# EAGLE schematic e-ink-display-v020-teardrop (EAGLE 7.3.0)
CNAME: e-ink-display; CREVISION: 0.0.3; DESIGNER: kennethlimcp

## Sheet 1 of 4: Power supply
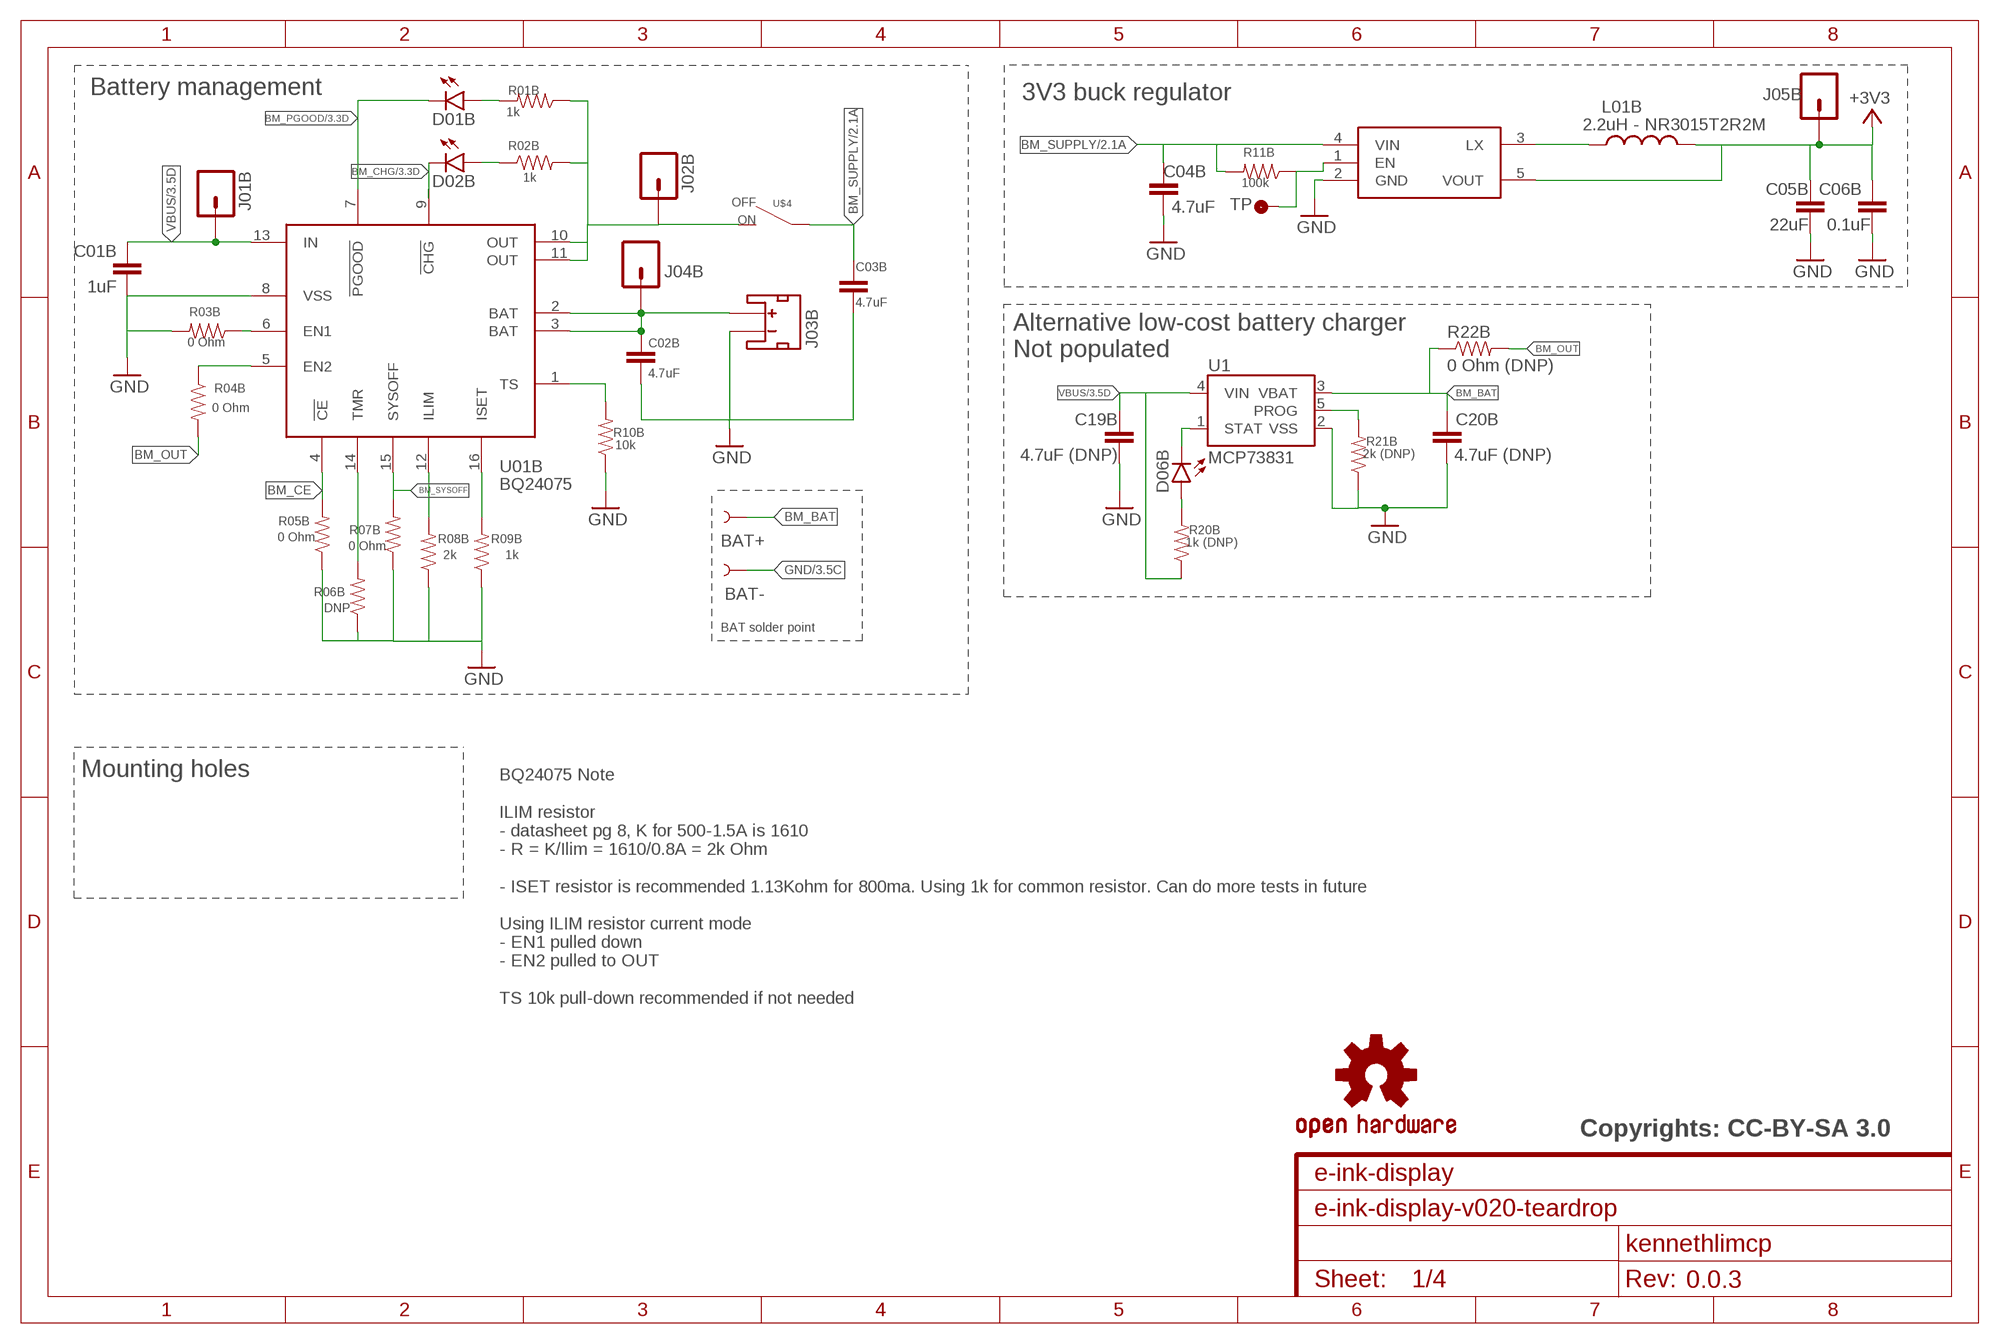
[diagram p0: schematic, sheet 1]

### Parts
BAT+  TEST-POINTBOTH_SQ  [TP_15_BOTH-SQ]
BAT-  TEST-POINTBOTHBOTH  [TP_15_BOTH]
C01B  1uF  CAP0603-CAP  [0603-CAP]
C02B  4.7uF  CAP0603-CAP  [0603-CAP]
C03B  4.7uF  CAP0603-CAP  [0603-CAP]
C04B  4.7uF  CAP0603-CAP  [0603-CAP]
C05B  22uF  CAP0603-CAP  [0603-CAP]
C06B  0.1uF  CAP0603-CAP  [0603-CAP]
C19B  4.7uF (DNP)  CAP0603-CAP  [0603-CAP]
C20B  4.7uF (DNP)  CAP0603-CAP  [0603-CAP]
D01B  LED0603  [LED-0603]
D02B  LED0603  [LED-0603]
D06B  LED0603  [LED-0603]
J01B  M01PTH  [1X01]
J02B  M01PTH  [1X01]
J03B  JST_2MM_MALE  [JST-2-SMD]
J04B  M01PTH  [1X01]
J05B  M01PTH  [1X01]
L01B  2.2uH - NR3015T2R2M  INDUCTOR-SPARKFUNNR3015T4R7M  [INDUCTOR-NR3015]
LOGO1  OSHW-LOGOPAD  [OSHW-LOGO-M-PAD]
R01B  1k  RESISTOR0603-RES  [0603-RES]
R02B  1k  RESISTOR0603-RES  [0603-RES]
R03B  0 Ohm  RESISTOR0603-RES  [0603-RES]
R04B  0 Ohm  RESISTOR0603  [0603-RES]
R05B  0 Ohm  RESISTOR0603  [0603-RES]
R06B  DNP  RESISTOR0603  [0603-RES]
R07B  0 Ohm  RESISTOR0603  [0603-RES]
R08B  2k  RESISTOR0603  [0603-RES]
R09B  1k  RESISTOR0603-RES  [0603-RES]
R10B  10k  RESISTOR0603  [0603-RES]
R11B  100k  RESISTOR0603  [0603-RES]
R20B  1k (DNP)  RESISTOR0603  [0603-RES]
R21B  2k (DNP)  RESISTOR0603  [0603-RES]
R22B  0 Ohm (DNP)  RESISTOR1206  [1206]
TP01B  TP1  [TP35_BOT]
U1  MCP73831  [SOT23-5]
U01B  BQ24075  BQ2407  [PVQFN-16]
U02B  R8008-33  [SOT23-5]
U$4  SWITCHSLIDE  [CHANGE_OVER_SLIDE]

### Nets
+3V3: C05B.2 C06B.2 J05B.1 L01B.2 U02B.5(VOUT) ; also sheet 3,4
BM_BAT: BAT+.P$1 C02B.2 C20B.2 J03B.2(+) J04B.1 R22B.1 U1.3(VBAT) U01B.2(BAT) U01B.3(BAT)
BM_CE: R05B.2 U01B.4(!CE)
BM_CHG: D02B.C U01B.9(!CHG) ; also sheet 3,4
BM_OUT: J02B.1 R01B.1 R02B.2 R04B.2 R22B.2 U01B.10(OUT) U01B.11(OUT) U$4.2
BM_PGOOD: D01B.C U01B.7(!PGOOD) ; also sheet 3,4
BM_SUPPLY: C03B.2 C04B.2 R11B.2 U02B.4(VIN) U$4.1 ; also sheet 2
BM_SYSOFF: R07B.2 U01B.15(SYSOFF)
GND: BAT-.P$1 C01B.1 C02B.1 C03B.1 C04B.1 C05B.1 C06B.1 C19B.1 C20B.1 J03B.1(-) R03B.2 R05B.1 R06B.1 R07B.1 R08B.1 R09B.1 R10B.1 R21B.1 U1.2(VSS) U01B.8(VSS) U02B.2(GND) ; also sheet 2,3,4
N$4: R08B.2 U01B.12(ILIM)
N$9: R09B.2 U01B.16(ISET)
N$11: R04B.1 U01B.5(EN2)
N$12: R03B.1 U01B.6(EN1)
N$13: R06B.2 U01B.14(TMR)
N$15: R10B.2 U01B.1(TS)
N$17: D02B.A R02B.1
N$18: D01B.A R01B.2
N$19: R21B.2 U1.5(PROG)
N$21: R11B.1 TP01B.P$1(TP) U02B.1(EN)
N$23: L01B.1 U02B.3(LX)
N$30: D06B.C U1.1(STAT)
N$37: D06B.A R20B.2
VBUS: C01B.2 C19B.2 J01B.1 R20B.1 U1.4(VIN) U01B.13(IN) ; also sheet 3
Unconnected: J03B.NC1(PAD1) J03B.NC2(PAD2)

### Notes on the sheet
- Battery management | 3V3 buck regulator
- Alternative low-cost battery charger
  Not populated
- BAT solder point
- Mounting holes
- BQ24075 Note
  
  ILIM resistor
  - datasheet pg 8, K for 500-1.5A is 1610
  - R = K/Ilim = 1610/0.8A = 2k Ohm
  
  - ISET resistor is recommended 1.13Kohm for 800ma. Using 1k for common resistor. Can do more tests in future
  
  Using ILIM resistor current mode
  - EN1 pulled down
  - EN2 pulled to OUT
  
  TS 10k pull-down recommended if not needed
- Copyrights: CC-BY-SA 3.0

## Sheet 2 of 4: e-ink power supply
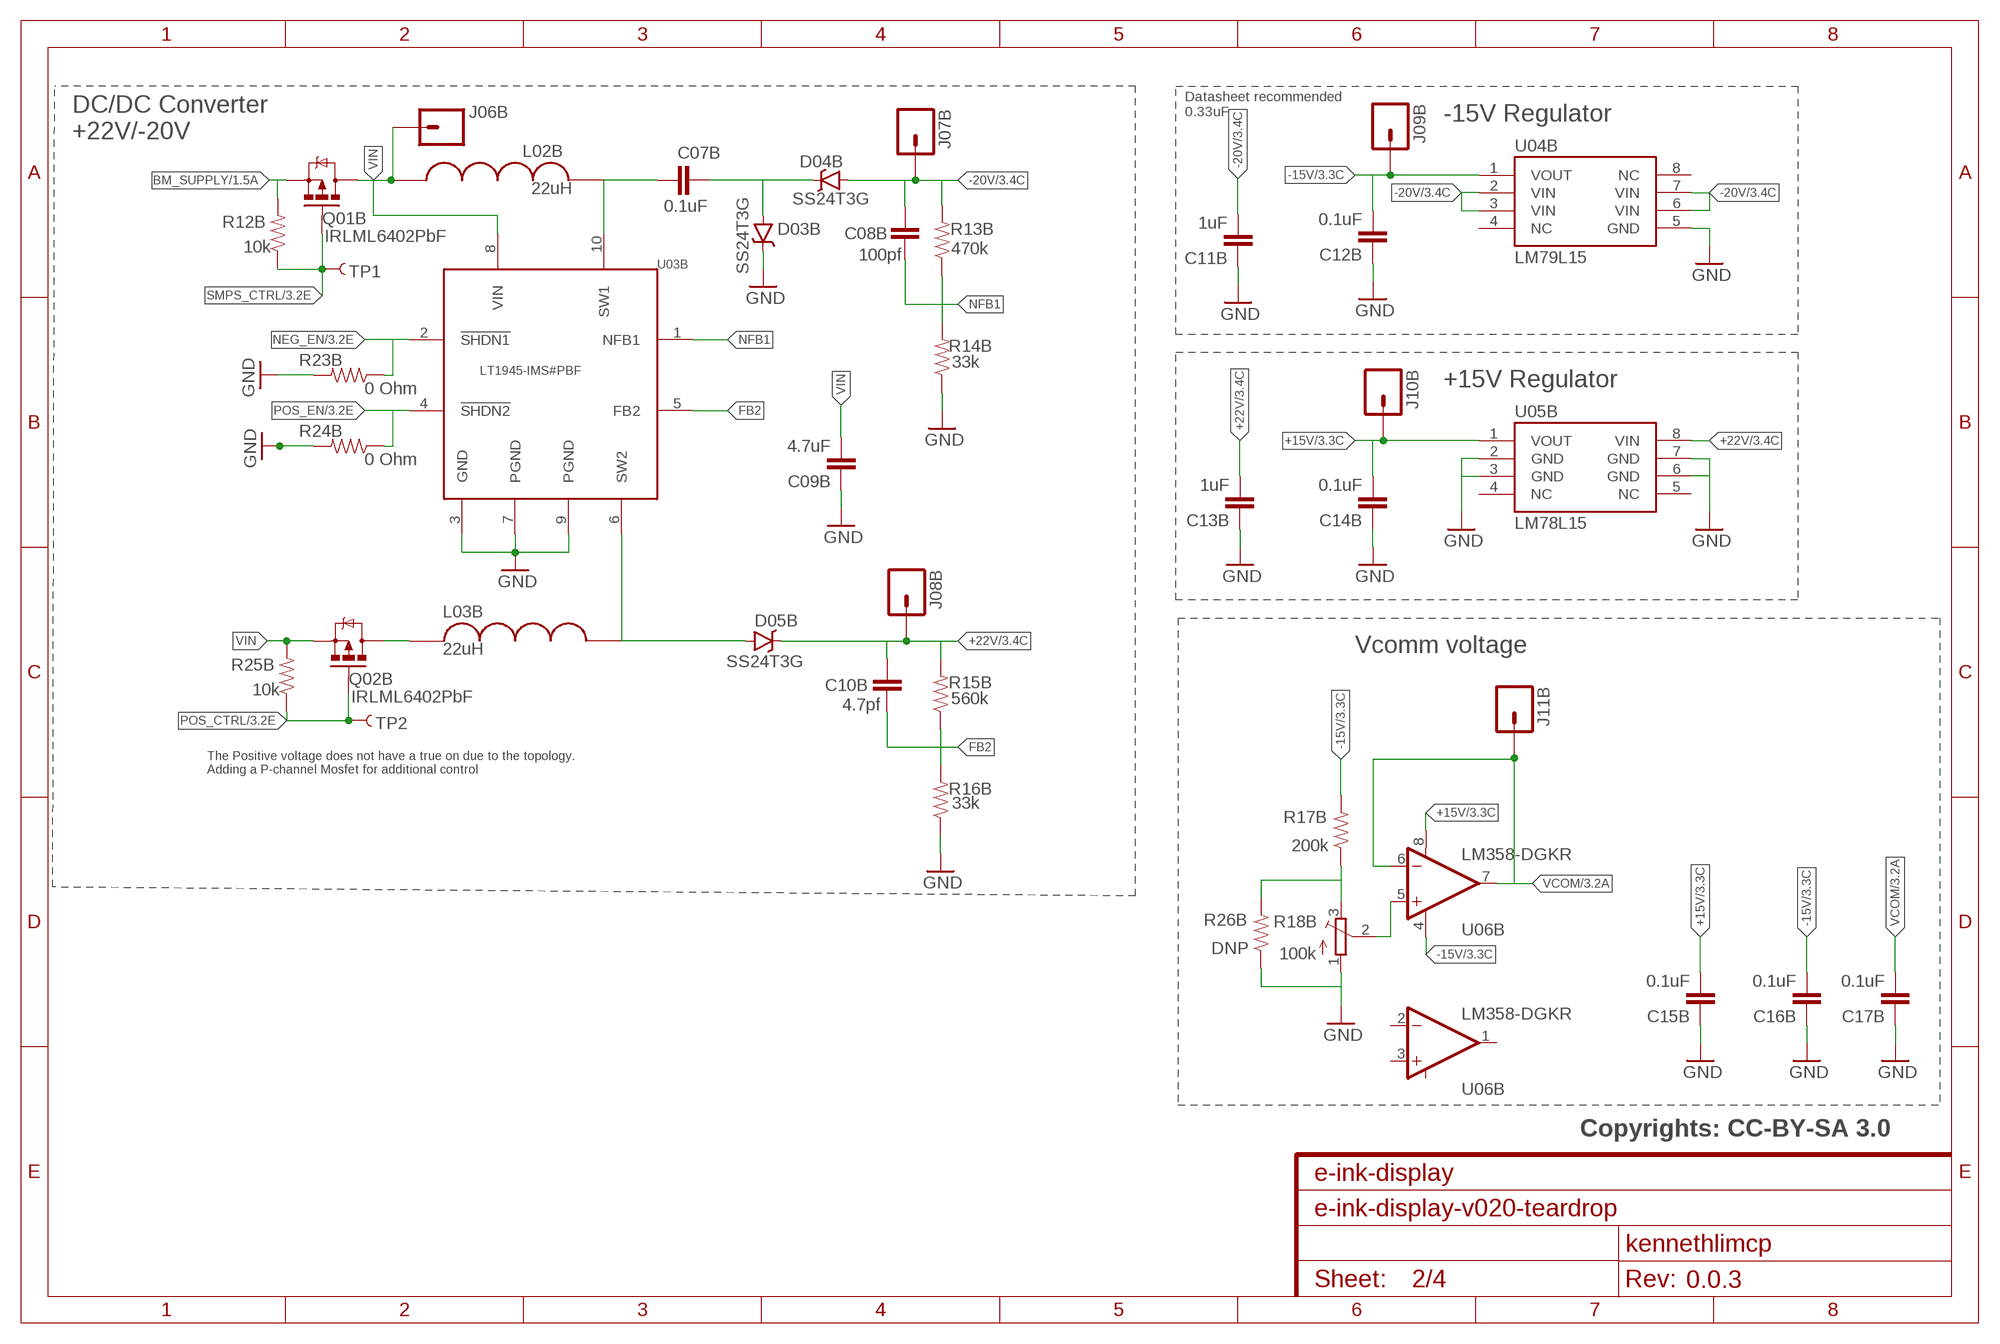
[diagram p1: schematic, sheet 2]

### Parts
C07B  0.1uF  CAP0603-CAP  [0603-CAP]
C08B  100pf  CAP0603-CAP  [0603-CAP]
C09B  4.7uF  CAP0603-CAP  [0603-CAP]
C10B  4.7pf  CAP0603-CAP  [0603-CAP]
C11B  1uF  CAP0603-CAP  [0603-CAP]
C12B  0.1uF  CAP0603-CAP  [0603-CAP]
C13B  1uF  CAP0603-CAP  [0603-CAP]
C14B  0.1uF  CAP0603-CAP  [0603-CAP]
C15B  0.1uF  CAP0603-CAP  [0603-CAP]
C16B  0.1uF  CAP0603-CAP  [0603-CAP]
C17B  0.1uF  CAP0603-CAP  [0603-CAP]
D03B  SS24T3G  [SMA-DIODE]
D04B  SS24T3G  [SMA-DIODE]
D05B  SS24T3G  [SMA-DIODE]
J06B  M01PTH  [1X01]
J07B  M01PTH  [1X01]
J08B  M01PTH  [1X01]
J09B  M01PTH  [1X01]
J10B  M01PTH  [1X01]
J11B  M01PTH  [1X01]
L02B  22uH  INDUCTOR  [4040(1515)]
L03B  22uH  INDUCTOR  [4040(1515)]
Q01B  IRLML6402PbF  MOSFET-PCHANNELSMD  [SOT23-3]
Q02B  IRLML6402PbF  MOSFET-PCHANNELSMD  [SOT23-3]
R12B  10k  RESISTOR0603  [0603-RES]
R13B  470k  RESISTOR0603  [0603-RES]
R14B  33k  RESISTOR0603  [0603-RES]
R15B  560k  RESISTOR0603  [0603-RES]
R16B  33k  RESISTOR0603  [0603-RES]
R17B  200k  RESISTOR0603  [0603-RES]
R18B  100k  TRIMPOTTC33X  [TC33X]
R23B  0 Ohm  RESISTOR0603  [0603-RES]
R24B  0 Ohm  RESISTOR0603  [0603-RES]
R25B  10k  RESISTOR0603  [0603-RES]
R26B  DNP  RESISTOR0603  [0603-RES]
TP1  TEST-POINTBOTHBOTH  [TP_15_BOTH]
TP2  TEST-POINTBOTHBOTH  [TP_15_BOTH]
U03B  LT1945-IMS#PBF  [MSOP-10]
U04B  LM79L15  [SO08]
U05B  LM78L15  [SO08]
U06B  LM358-DGKR  [MSOP-8]

### Nets
+15V: C14B.2 C15B.2 J10B.1 U05B.1(VOUT) U06B.8(V+) ; also sheet 3
+22V: C10B.2 C13B.2 D05B.C J08B.1 R15B.2 U05B.8(VIN) ; also sheet 3
-15V: C12B.2 C16B.2 J09B.1 R17B.2 U04B.1(VOUT) U06B.4(V-) ; also sheet 3
-20V: C08B.2 C11B.2 D04B.A J07B.1 R13B.2 U04B.2(VIN) U04B.3(VIN) U04B.6(VIN) U04B.7(VIN) ; also sheet 3
BM_SUPPLY: Q01B.2(S) R12B.2 ; also sheet 1
FB2: C10B.1 R15B.1 R16B.2 U03B.5(FB2)
GND: C09B.1 C11B.1 C12B.1 C13B.1 C14B.1 C15B.1 C16B.1 C17B.1 D03B.C R14B.1 R16B.1 R18B.1(A) R23B.2 R24B.2 R26B.1 U03B.3(GND) U03B.7(PGND) U03B.9(PGND) U04B.5(GND) U05B.2(GND) U05B.3(GND) U05B.6(GND) U05B.7(GND) ; also sheet 1,3,4
N$2: C07B.1 L02B.P$2 U03B.10(SW1)
N$3: C07B.2 D03B.A D04B.C
N$6: R18B.2(S) U06B.5(+IN2)
N$8: D05B.A L03B.P$2 U03B.6(SW2)
N$25: L03B.P$1 Q02B.3(D)
N$36: R17B.1 R18B.3(E) R26B.2
NEG_EN: R23B.1 U03B.2(!SHDN1) ; also sheet 3
NFB1: C08B.1 R13B.1 R14B.2 U03B.1(NFB1)
POS_CTRL: Q02B.1(G) R25B.1 TP2.P$1 ; also sheet 3
POS_EN: R24B.1 U03B.4(!SHDN2) ; also sheet 3
SMPS_CTRL: Q01B.1(G) R12B.1 TP1.P$1 ; also sheet 3
VCOM: C17B.2 J11B.1 U06B.6(-IN2) U06B.7(OUT2) ; also sheet 3
VIN: C09B.2 J06B.1 L02B.P$1 Q01B.3(D) Q02B.2(S) R25B.2 U03B.8(VIN)
Unconnected: U04B.4(NC) U04B.8(NC) U05B.4(NC) U05B.5(NC) U06B.1(OUT1) U06B.2(-IN1) U06B.3(+IN1)

### Notes on the sheet
- Datasheet recommended
  0.33uF
- -15V Regulator
- DC/DC Converter
  +22V/-20V
- +15V Regulator
- Vcomm voltage
- The Positive voltage does not have a true on due to the topology. 
  Adding a P-channel Mosfet for additional control
- Copyrights: CC-BY-SA 3.0

## Sheet 3 of 4: e-ink display & MCU
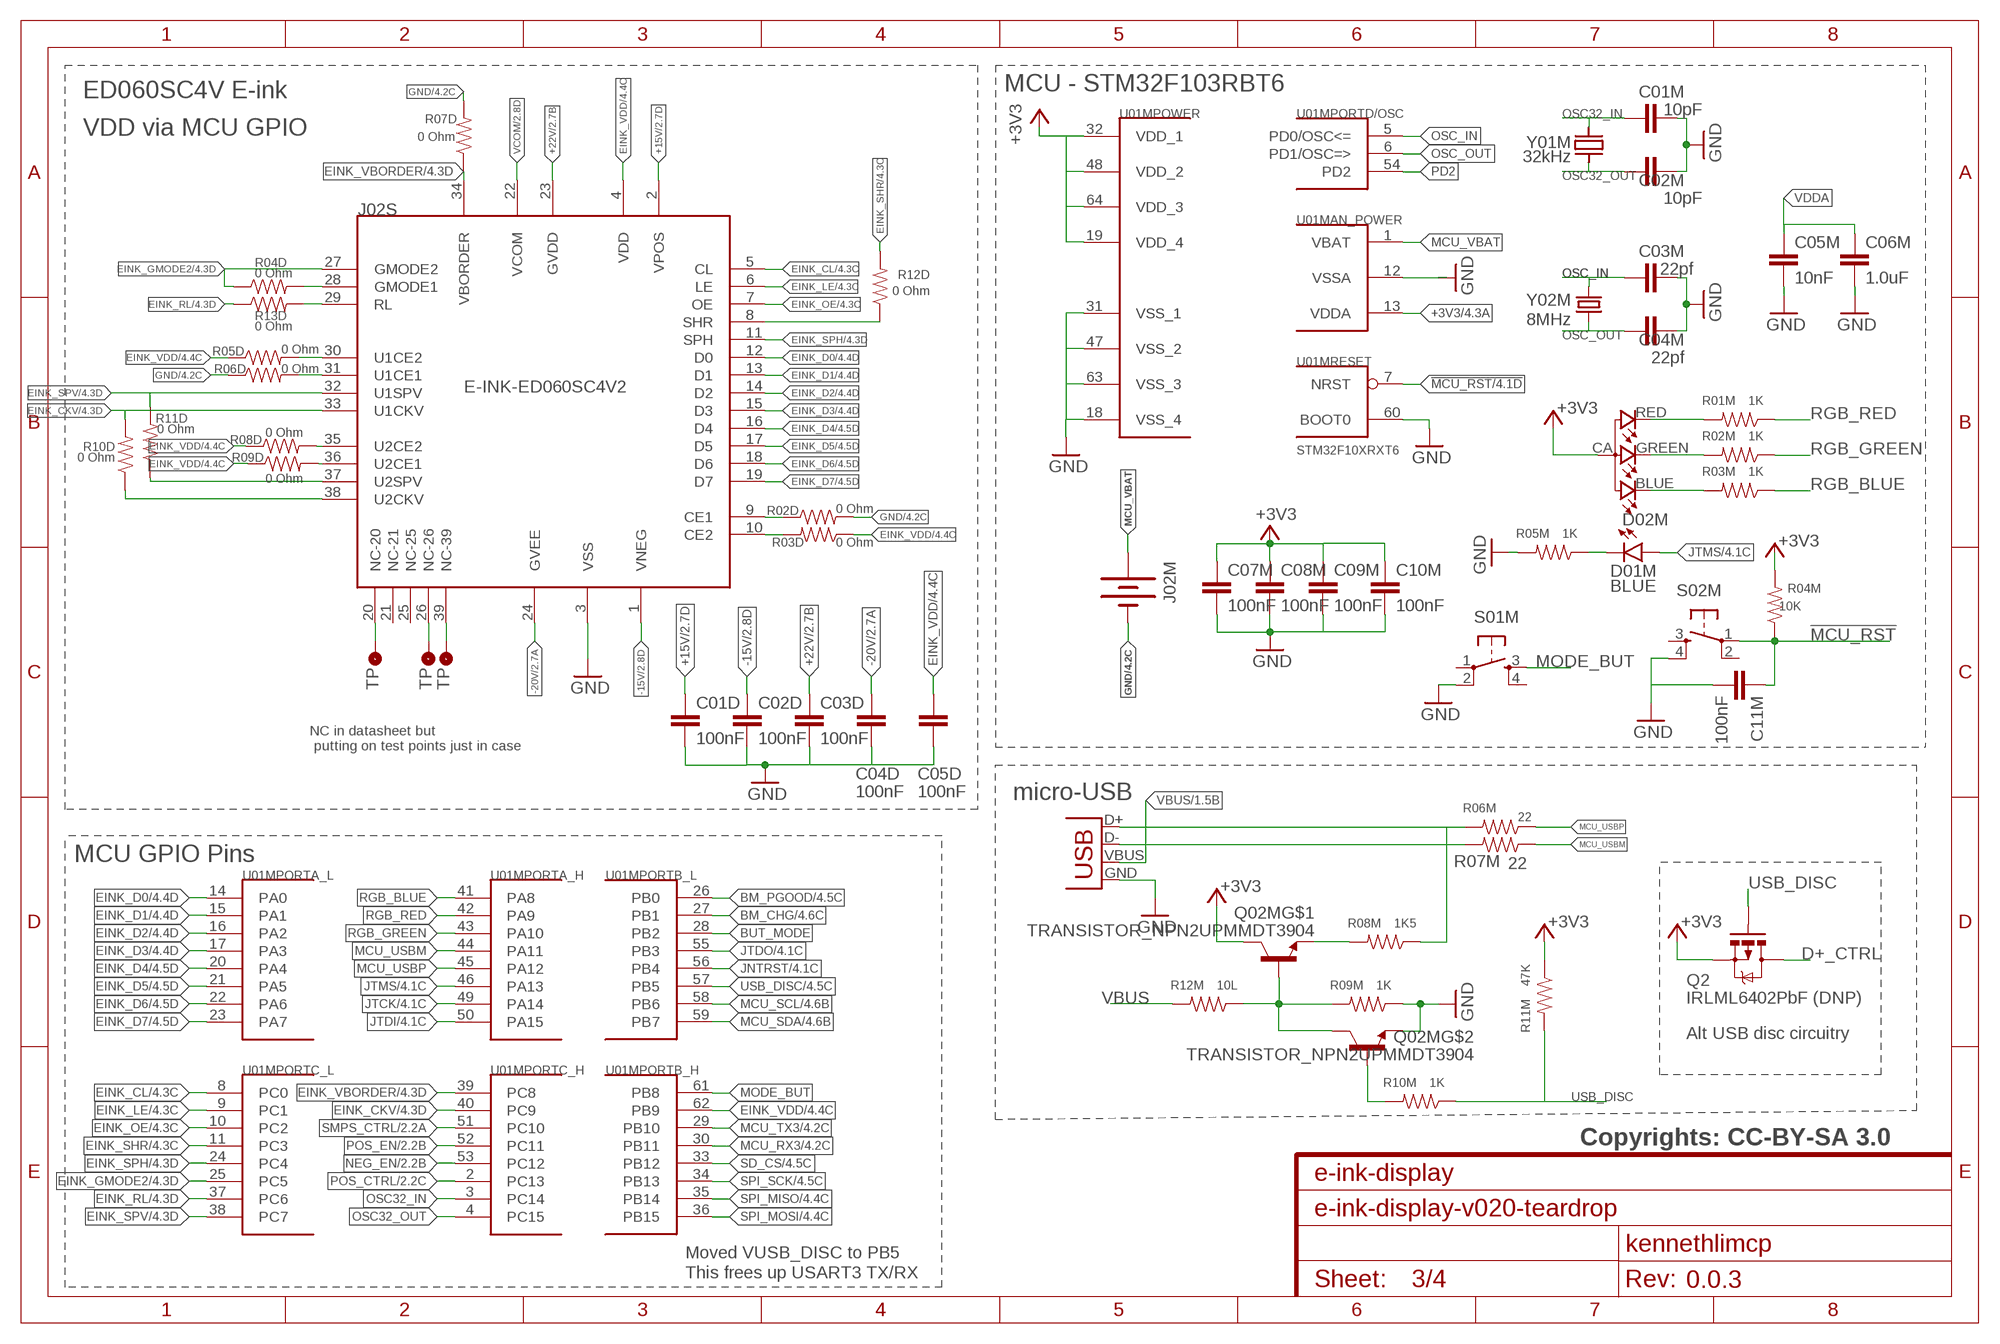
[diagram p2: schematic, sheet 3]

### Parts
C01D  100nF  0.1UF-25V(+80/-20%)(0603)  [0603-CAP]
C01M  10pF  10PF-50V-5%(0603)  [0603-CAP]
C02D  100nF  0.1UF-25V(+80/-20%)(0603)  [0603-CAP]
C02M  10pF  10PF-50V-5%(0603)  [0603-CAP]
C03D  100nF  0.1UF-25V(+80/-20%)(0603)  [0603-CAP]
C03M  22pf  CAP0603-CAP  [0603-CAP]
C04D  100nF  0.1UF-25V(+80/-20%)(0603)  [0603-CAP]
C04M  22pf  CAP0603-CAP  [0603-CAP]
C05D  100nF  0.1UF-25V(+80/-20%)(0603)  [0603-CAP]
C05M  10nF  0.1UF-25V(+80/-20%)(0603)  [0603-CAP]
C06M  1.0uF  1.0UF-16V-10%(0603)  [0603-CAP]
C07M  100nF  0.1UF-25V(+80/-20%)(0603)  [0603-CAP]
C08M  100nF  0.1UF-25V(+80/-20%)(0603)  [0603-CAP]
C09M  100nF  0.1UF-25V(+80/-20%)(0603)  [0603-CAP]
C10M  100nF  0.1UF-25V(+80/-20%)(0603)  [0603-CAP]
C11M  100nF  0.1UF-25V(+80/-20%)(0603)  [0603-CAP]
D01M  BLUE  LED0603  [LED-0603]
D02M  RGB-LED-CLMVB-FKARGB  [PLCC4-2MM-RGB]
J01M  USBUSB-MICROB-PAD-EXTEND  [USB-MICROB-SLOT-HOLE-EXTEND]
J02M  BATTERY20PTH  [BATTCOM_20MM_PTH]
J02S  E-INK-ED060SC4V2  [FPC-0.3-39]
Q2  IRLML6402PbF (DNP)  MOSFET-PCHANNELSMD  [SOT23-3]
Q02M  TRANSISTOR_NPN2UPMMDT3904  [SOT363]
R01M  1K  RESISTOR0603-RES  [0603-RES]
R02D  0 Ohm  RESISTOR0603-RES  [0603-RES]
R02M  1K  RESISTOR0603-RES  [0603-RES]
R03D  0 Ohm  RESISTOR0603-RES  [0603-RES]
R03M  1K  RESISTOR0603-RES  [0603-RES]
R04D  0 Ohm  RESISTOR0603-RES  [0603-RES]
R04M  10K  RESISTOR0603-RES  [0603-RES]
R05D  0 Ohm  RESISTOR0603-RES  [0603-RES]
R05M  1K  RESISTOR0603-RES  [0603-RES]
R06D  0 Ohm  RESISTOR0603-RES  [0603-RES]
R06M  22  RESISTOR0603-RES  [0603-RES]
R07D  0 Ohm  RESISTOR0603-RES  [0603-RES]
R07M  22  RESISTOR0603-RES  [0603-RES]
R08D  0 Ohm  RESISTOR0603-RES  [0603-RES]
R08M  1K5  RESISTOR0603-RES  [0603-RES]
R09D  0 Ohm  RESISTOR0603-RES  [0603-RES]
R09M  1K  RESISTOR0603-RES  [0603-RES]
R10D  0 Ohm  RESISTOR0603-RES  [0603-RES]
R10M  1K  RESISTOR0603-RES  [0603-RES]
R11D  0 Ohm  RESISTOR0603-RES  [0603-RES]
R11M  47K  RESISTOR0603-RES  [0603-RES]
R12D  0 Ohm  RESISTOR0603-RES  [0603-RES]
R12M  10L  RESISTOR0603-RES  [0603-RES]
R13D  0 Ohm  RESISTOR0603-RES  [0603-RES]
S01M  TAC_SWITCHSMD  [TACTILE_SWITCH_SMD]
S02M  TAC_SWITCHSMD  [TACTILE_SWITCH_SMD]
U01M  STM32F10XRXT6  [TQFP64]
U$1  TP1  [TP35_BOT]
U$8  TP1  [TP35_BOT]
U$9  TP1  [TP35_BOT]
Y01M  32kHz  Q_FC135  [FC135]
Y02M  8MHz  CRYSTAL5X3  [CRYSTAL-SMD-5X3]

### Nets
!MCU_RST: C11M.1 R04M.1 S02M.1 U01M.7(RESET:NRST) ; also sheet 4
+3V3: C07M.1 C08M.1 C09M.1 C10M.1 D02M.CA Q2.2(S) Q02M.6(C) R04M.2 R11M.1 U01M.13(AN_POWER:VDDA) U01M.19(POWER:VDD_4) U01M.32(POWER:VDD_1) U01M.48(POWER:VDD_2) U01M.64(POWER:VDD_3) ; also sheet 1,4
+15V: C01D.1 J02S.2(VPOS) ; also sheet 2
+22V: C03D.1 J02S.23(GVDD) ; also sheet 2
-15V: C02D.1 J02S.1(VNEG) ; also sheet 2
-20V: C04D.1 J02S.24(GVEE) ; also sheet 2
BM_CHG: U01M.27(PORTB_L:PB1) ; also sheet 1,4
BM_PGOOD: U01M.26(PORTB_L:PB0) ; also sheet 1,4
BUT_MODE: U01M.28(PORTB_L:PB2)
CE2: J02S.10(CE2) R03D.2
D+_CTRL: Q2.3(D) Q02M.1(E) R08M.2
EINK_CKV: J02S.33(U1CKV) R10D.2 U01M.40(PORTC_H:PC9) ; also sheet 4
EINK_CL: J02S.5(CL) U01M.8(PORTC_L:PC0) ; also sheet 4
EINK_D0: J02S.12(D0) U01M.14(PORTA_L:PA0) ; also sheet 4
EINK_D1: J02S.13(D1) U01M.15(PORTA_L:PA1) ; also sheet 4
EINK_D2: J02S.14(D2) U01M.16(PORTA_L:PA2) ; also sheet 4
EINK_D3: J02S.15(D3) U01M.17(PORTA_L:PA3) ; also sheet 4
EINK_D4: J02S.16(D4) U01M.20(PORTA_L:PA4) ; also sheet 4
EINK_D5: J02S.17(D5) U01M.21(PORTA_L:PA5) ; also sheet 4
EINK_D6: J02S.18(D6) U01M.22(PORTA_L:PA6) ; also sheet 4
EINK_D7: J02S.19(D7) U01M.23(PORTA_L:PA7) ; also sheet 4
EINK_GMODE2: J02S.27(GMODE2) R04D.1 U01M.25(PORTC_L:PC5) ; also sheet 4
EINK_LE: J02S.6(LE) U01M.9(PORTC_L:PC1) ; also sheet 4
EINK_OE: J02S.7(OE) U01M.10(PORTC_L:PC2) ; also sheet 4
EINK_RL: R13D.1 U01M.37(PORTC_L:PC6) ; also sheet 4
EINK_SHR: R12D.2 U01M.11(PORTC_L:PC3) ; also sheet 4
EINK_SPH: J02S.11(SPH) U01M.24(PORTC_L:PC4) ; also sheet 4
EINK_SPV: J02S.32(U1SPV) R11D.2 U01M.38(PORTC_L:PC7) ; also sheet 4
EINK_VBORDER: J02S.34(VBORDER) R07D.1 U01M.39(PORTC_H:PC8) ; also sheet 4
EINK_VDD: C05D.1 J02S.4(VDD) R03D.1 R05D.1 R08D.1 R09D.1 U01M.62(PORTB_H:PB9) ; also sheet 4
GND: C01D.2 C01M.2 C02D.2 C02M.2 C03D.2 C03M.2 C04D.2 C04M.2 C05D.2 C05M.2 C06M.2 C07M.2 C08M.2 C09M.2 C10M.2 C11M.2 J01M.GND J02M.2(-) J02S.3(VSS) Q02M.4(E) R02D.2 R05M.2 R06D.1 R07D.2 R09M.1 S01M.2 S02M.4 U01M.12(AN_POWER:VSSA) U01M.18(POWER:VSS_4) U01M.31(POWER:VSS_1) U01M.47(POWER:VSS_2) U01M.60(RESET:BOOT0) U01M.63(POWER:VSS_3) ; also sheet 1,2,4
JNTRST: U01M.56(PORTB_L:PB4) ; also sheet 4
JTCK: U01M.49(PORTA_H:PA14) ; also sheet 4
JTDI: U01M.50(PORTA_H:PA15) ; also sheet 4
JTDO: U01M.55(PORTB_L:PB3) ; also sheet 4
JTMS: D01M.A U01M.46(PORTA_H:PA13) ; also sheet 4
MCU_RX3: U01M.30(PORTB_H:PB11) ; also sheet 4
MCU_SCL: U01M.58(PORTB_L:PB6) ; also sheet 4
MCU_SDA: U01M.59(PORTB_L:PB7) ; also sheet 4
MCU_TX3: U01M.29(PORTB_H:PB10) ; also sheet 4
MCU_USBM: R07M.1 U01M.44(PORTA_H:PA11)
MCU_USBP: R06M.1 U01M.45(PORTA_H:PA12)
MCU_VBAT: J02M.1(+) U01M.1(AN_POWER:VBAT)
MODE_BUT: S01M.3 U01M.61(PORTB_H:PB8)
N$: J01M.D+ R06M.2 R08M.1
N$1: J02S.28(GMODE1) R04D.2
N$5: J02S.31(U1CE1) R06D.2
N$14: D02M.RED R01M.2
N$22: Q02M.2(B) Q02M.3(C) R09M.2 R12M.1
N$24: J02S.29(RL) R13D.2
N$26: J02S.35(U2CE2) R08D.2
N$27: J02S.36(U2CE1) R09D.2
N$28: J02S.9(CE1) R02D.1
N$29: J02S.20(NC-20) U$1.P$1(TP)
N$31: J02S.26(NC-26) U$8.P$1(TP)
N$32: J02S.8(SHR) R12D.1
N$33: J02S.39(NC-39) U$9.P$1(TP)
N$35: Q02M.5(B) R10M.2
N$38: D01M.C R05M.1
N$100: J01M.D- R07M.2
NEG_EN: U01M.53(PORTC_H:PC12) ; also sheet 2
OSC32_IN: C01M.1 U01M.3(PORTC_H:PC14) Y01M.X2
OSC32_OUT: C02M.1 U01M.4(PORTC_H:PC15) Y01M.X1
OSC_IN: C03M.1 U01M.5(PORTD/OSC:PD0/OSC<=) Y02M.3
OSC_OUT: C04M.1 U01M.6(PORTD/OSC:PD1/OSC=>) Y02M.1
PD2: U01M.54(PORTD/OSC:PD2)
POS_CTRL: U01M.2(PORTC_H:PC13) ; also sheet 2
POS_EN: U01M.52(PORTC_H:PC11) ; also sheet 2
R02M: D02M.GREEN R02M.2
R03M: D02M.BLUE R03M.2
RGB_BLUE: R03M.1 U01M.41(PORTA_H:PA8)
RGB_GREEN: R02M.1 U01M.43(PORTA_H:PA10)
RGB_RED: R01M.1 U01M.42(PORTA_H:PA9)
SD_CS: U01M.33(PORTB_H:PB12) ; also sheet 4
SMPS_CTRL: U01M.51(PORTC_H:PC10) ; also sheet 2
SPI_MISO: U01M.35(PORTB_H:PB14) ; also sheet 4
SPI_MOSI: U01M.36(PORTB_H:PB15) ; also sheet 4
SPI_SCK: U01M.34(PORTB_H:PB13) ; also sheet 4
U1CE2: J02S.30(U1CE2) R05D.2
U2CKV: J02S.38(U2CKV) R10D.1
U2SPV: J02S.37(U2SPV) R11D.1
USB_DISC: Q2.1(G) R10M.1 R11M.2 U01M.57(PORTB_L:PB5) ; also sheet 4
VBUS: J01M.VBUS R12M.2 ; also sheet 1
VCOM: J02S.22(VCOM) ; also sheet 2
VDDA: C05M.1 C06M.1
Unconnected: J02S.21(NC-21) J02S.25(NC-25) S01M.1 S01M.4 S02M.2 S02M.3

### Notes on the sheet
- MCU - STM32F103RBT6
- ED060SC4V E-ink
  
  VDD via MCU GPIO
- NC in datasheet but
   putting on test points just in case
- micro-USB
- MCU GPIO Pins
- Alt USB disc circuitry
- Copyrights: CC-BY-SA 3.0
- Moved VUSB_DISC to PB5 
  This frees up USART3 TX/RX

## Sheet 4 of 4: Peripherals
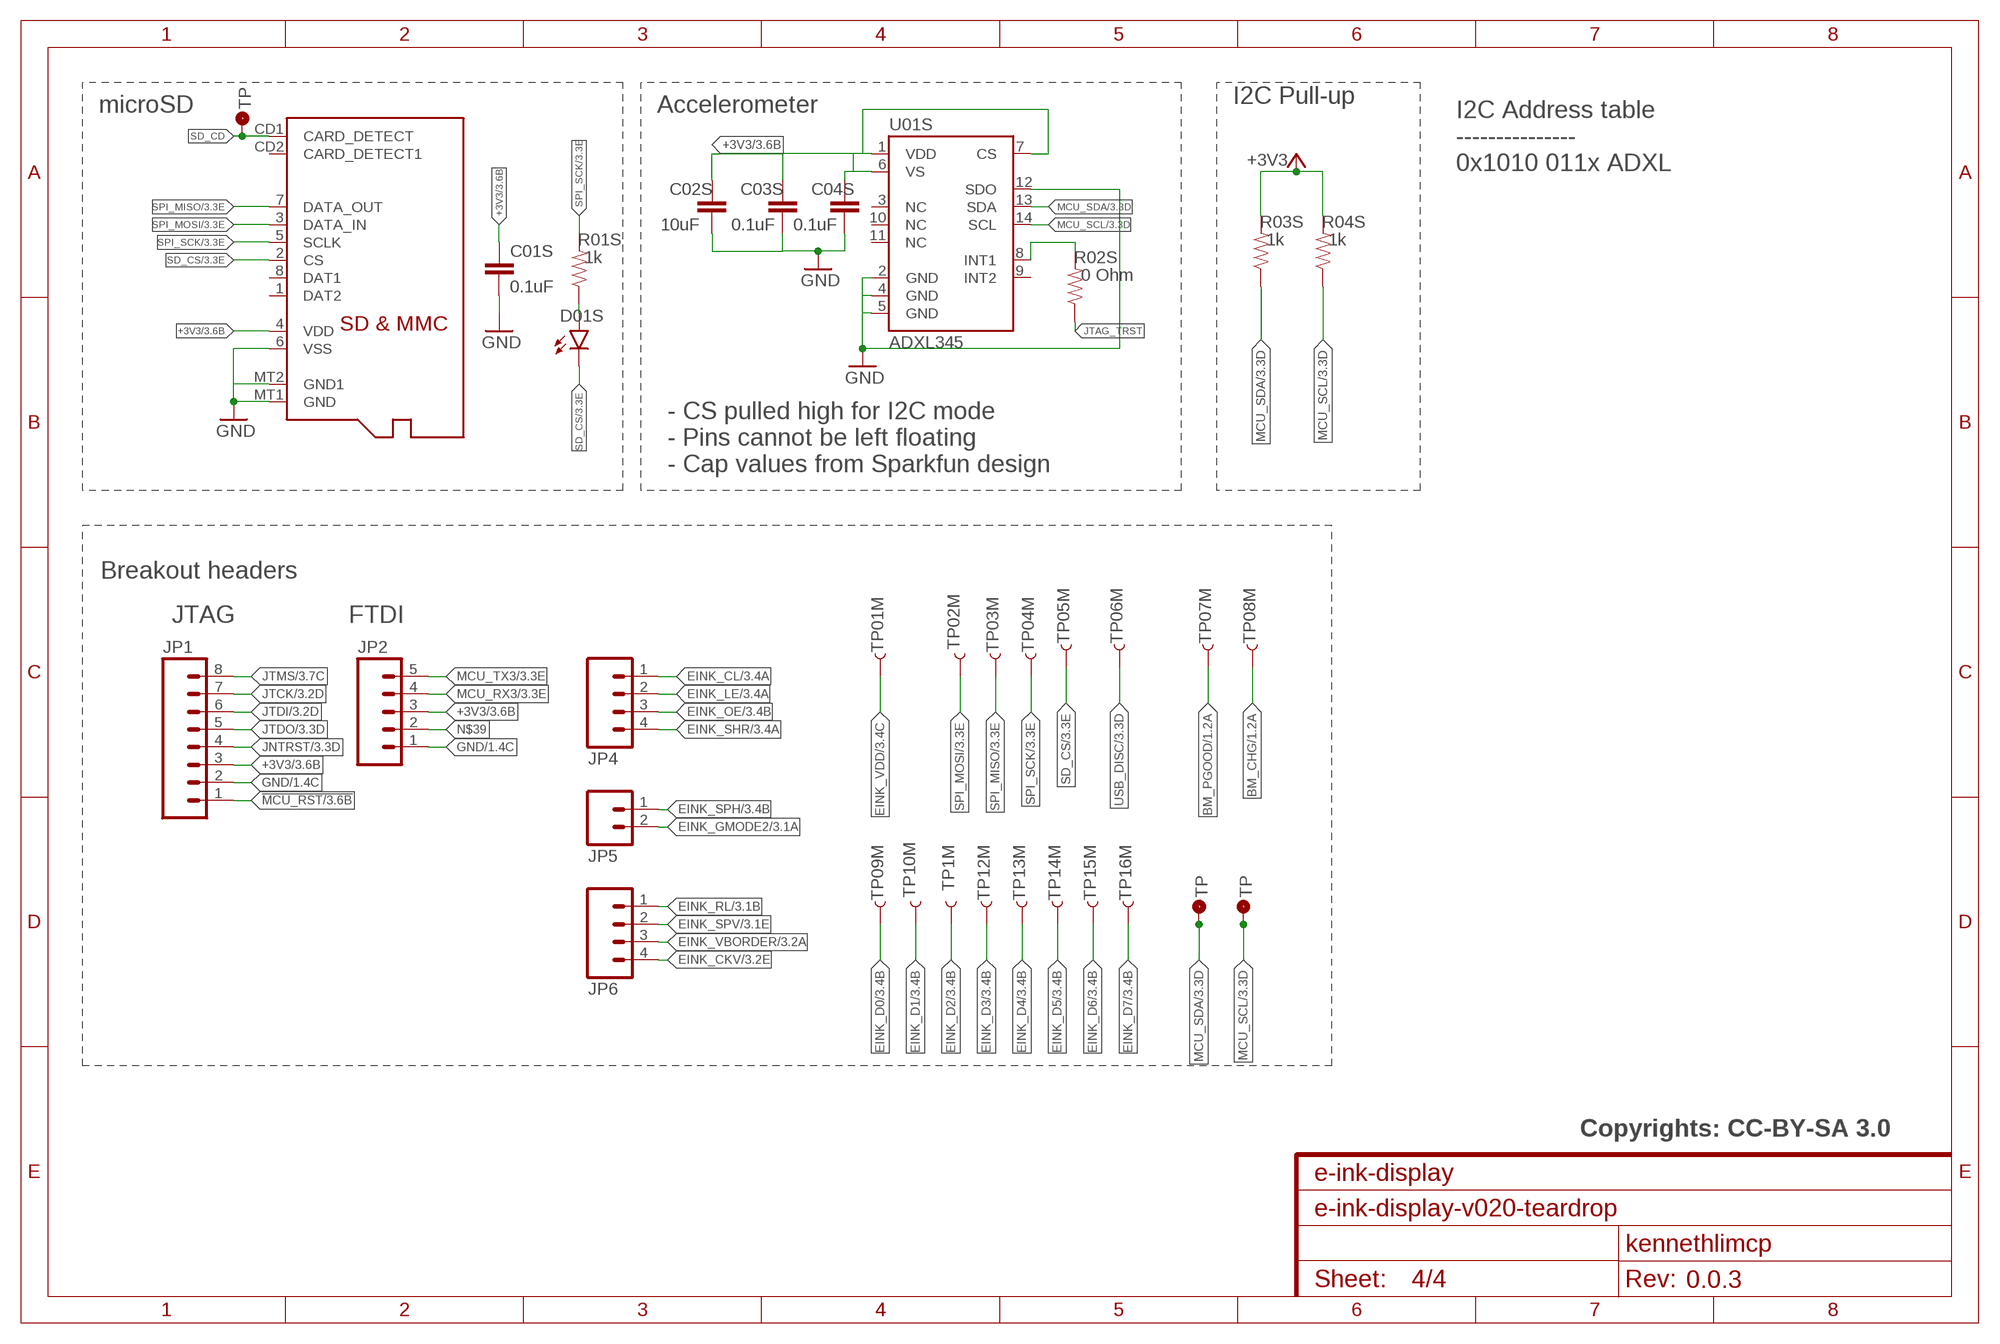
[diagram p3: schematic, sheet 4]

### Parts
C01S  0.1uF  CAP0603-CAP  [0603-CAP]
C02S  10uF  CAP0603-CAP  [0603-CAP]
C03S  0.1uF  CAP0603-CAP  [0603-CAP]
C04S  0.1uF  CAP0603-CAP  [0603-CAP]
D01S  LED0603  [LED-0603]
J01S  MICROSD  [MICROSD]
JP1  M08  [1X08_ROUND]
JP2  M05PTH  [1X05]
JP4  M04PTH  [1X04]
JP5  M02PTH  [1X02]
JP6  M04PTH  [1X04]
R01S  1k  RESISTOR0603-RES  [0603-RES]
R02S  0 Ohm  RESISTOR0603  [0603-RES]
R03S  1k  RESISTOR0603-RES  [0603-RES]
R04S  1k  RESISTOR0603-RES  [0603-RES]
TP01M  TEST-POINTBOTHBOTH  [TP_15_BOTH]
TP1M  TEST-POINTBOTHBOTH  [TP_15_BOTH]
TP02M  TEST-POINTBOTHBOTH  [TP_15_BOTH]
TP03M  TEST-POINTTP_15TH_THRU  [TP_15TH]
TP04M  TEST-POINTBOTHBOTH  [TP_15_BOTH]
TP05M  TEST-POINTBOTHBOTH  [TP_15_BOTH]
TP06M  TEST-POINTBOTHBOTH  [TP_15_BOTH]
TP07M  TEST-POINTBOTHBOTH  [TP_15_BOTH]
TP08M  TEST-POINTBOTHBOTH  [TP_15_BOTH]
TP09M  TEST-POINTBOTHBOTH  [TP_15_BOTH]
TP10M  TEST-POINTBOTHBOTH  [TP_15_BOTH]
TP12M  TEST-POINTBOTHBOTH  [TP_15_BOTH]
TP13M  TEST-POINTBOTHBOTH  [TP_15_BOTH]
TP14M  TEST-POINTBOTHBOTH  [TP_15_BOTH]
TP15M  TEST-POINTBOTHBOTH  [TP_15_BOTH]
TP16M  TEST-POINTBOTHBOTH  [TP_15_BOTH]
TP17M  TP1  [TP35_BOT]
TP18M  TP1  [TP35_BOT]
U01S  ADXL345  [LGA14]
U$5  TP3  [TP60_BOT]

### Nets
!MCU_RST: JP1.1 ; also sheet 3
+3V3: C01S.1 C02S.1 C03S.1 C04S.1 J01S.4(VDD) JP1.3 JP2.3 R03S.2 R04S.2 U01S.1(VDD) U01S.6(VS) U01S.7(CS) ; also sheet 1,3
BM_CHG: TP08M.P$1 ; also sheet 1,3
BM_PGOOD: TP07M.P$1 ; also sheet 1,3
EINK_CKV: JP6.4 ; also sheet 3
EINK_CL: JP4.1 ; also sheet 3
EINK_D0: TP09M.P$1 ; also sheet 3
EINK_D1: TP10M.P$1 ; also sheet 3
EINK_D2: TP1M.P$1 ; also sheet 3
EINK_D3: TP12M.P$1 ; also sheet 3
EINK_D4: TP13M.P$1 ; also sheet 3
EINK_D5: TP14M.P$1 ; also sheet 3
EINK_D6: TP15M.P$1 ; also sheet 3
EINK_D7: TP16M.P$1 ; also sheet 3
EINK_GMODE2: JP5.2 ; also sheet 3
EINK_LE: JP4.2 ; also sheet 3
EINK_OE: JP4.3 ; also sheet 3
EINK_RL: JP6.1 ; also sheet 3
EINK_SHR: JP4.4 ; also sheet 3
EINK_SPH: JP5.1 ; also sheet 3
EINK_SPV: JP6.2 ; also sheet 3
EINK_VBORDER: JP6.3 ; also sheet 3
EINK_VDD: TP01M.P$1 ; also sheet 3
GND: C01S.2 C02S.2 C03S.2 C04S.2 J01S.6(VSS) J01S.MT1(GND) J01S.MT2(GND1) JP1.2 JP2.1 U01S.2(GND) U01S.4(GND) U01S.5(GND) U01S.12(SDO) ; also sheet 1,2,3
JNTRST: JP1.4 ; also sheet 3
JTAG_TRST: R02S.1
JTCK: JP1.7 ; also sheet 3
JTDI: JP1.6 ; also sheet 3
JTDO: JP1.5 ; also sheet 3
JTMS: JP1.8 ; also sheet 3
MCU_RX3: JP2.4 ; also sheet 3
MCU_SCL: R04S.1 TP18M.P$1(TP) U01S.14(SCL) ; also sheet 3
MCU_SDA: R03S.1 TP17M.P$1(TP) U01S.13(SDA) ; also sheet 3
MCU_TX3: JP2.5 ; also sheet 3
N$10: R02S.2 U01S.8(INT1)
N$39: JP2.2
R01S: D01S.A R01S.1
SD_CD: J01S.CD1(CARD_DETECT) U$5.P$1(TP)
SD_CS: D01S.C J01S.2(CS) TP05M.P$1 ; also sheet 3
SPI_MISO: J01S.7(DATA_OUT) TP03M.P$1 ; also sheet 3
SPI_MOSI: J01S.3(DATA_IN) TP02M.P$1 ; also sheet 3
SPI_SCK: J01S.5(SCLK) R01S.2 TP04M.P$1 ; also sheet 3
USB_DISC: TP06M.P$1 ; also sheet 3
Unconnected: J01S.1(DAT2) J01S.8(DAT1) J01S.CD2(CARD_DETECT1) U01S.3(NC) U01S.9(INT2) U01S.10(NC) U01S.11(NC)

### Notes on the sheet
- I2C Pull-up
- microSD | Accelerometer
- I2C Address table
  ---------------
  0x1010 011x ADXL
- - CS pulled high for I2C mode
  - Pins cannot be left floating
  - Cap values from Sparkfun design
- Breakout headers
- JTAG | FTDI
- Copyrights: CC-BY-SA 3.0

## Library data of the parts
BAT+ BAT- TP1 TP01M TP1M TP2 TP02M TP04M TP05M TP06M TP07M TP08M TP09M TP10M TP12M TP13M TP14M TP15M TP16M = kennethlimcp:TEST-POINT: Bare copper test points for troubleshooting or ICT
C01B C01S C02B C02S C03B C03M C03S C04B C04M C04S C05B C06B C07B C08B C09B C10B C11B C12B C13B C14B C15B C16B C17B C19B C20B = SparkFun-Capacitors:CAP: Capacitor Standard 0603 ceramic capacitor, and 0.1" leaded capacitor.
C01D C02D C03D C04D C05D C05M C07M C08M C09M C10M C11M = SparkFun-Capacitors:0.1UF-25V(+80/-20%)(0603): CAP-00810 Ceramic Standard decoupling cap; PROD_ID: CAP-00810; VALUE: 0.1uF
C01M C02M = SparkFun-Capacitors:10PF-50V-5%(0603): CAP-11812; PROD_ID: CAP-11812
C06M = SparkFun-Capacitors:1.0UF-16V-10%(0603): CAP-00868; PROD_ID: CAP-00868
D01B D01M D01S D02B D06B = SparkFun-LED:LED: LEDs Standard schematic elements and footprints for 5mm, 3mm, 1206, and 0603 sized LEDs. 5mm - Spark Fun Electronics SKU : COM-00529 (and others)
D02M = Spark:RGB-LED-CLMVB-FKA: CREE CLMVB-FKA RGB LED 2mm x 2mm
D03B D04B D05B = kennethlimcp:SS24T3G: SS24T3G, Schottky diode 40V, 1A, Vf 500mV Package: DO-214AA
J01B J02B J04B J05B J06B J07B J08B J09B J10B J11B = SparkFun-Connectors:M01: Header 1 Standard 1-pin 0.1" header. Use with straight break away headers (SKU : PRT-00116), right angle break away headers (PRT-00553), swiss pins (PRT-00743), machine pins (PRT-00117), and female headers (PRT-00115).
J01M = Spark:USB
J01S = adafruit:MICROSD: Micro-SD / Transflash card holder with SPI pinout For the 3M # 2908-05WB-MG and/or 4UCON #19656 push-push type
J02M = SparkFun-Electromechanical:BATTERY: Battery Holders Various common sizes : AA, AAA, 18650 (PRT-12895), 20mm coin cell and 12mm coin cell. 20MM_4LEGS, BATT-10373
J02S = kennethlimcp:E-INK-ED060SC4V2
J03B = SparkFun-Connectors:JST_2MM_MALE: Mates to single-cell LiPo batteries. CONN-11443 Now with smashable polarity marks!; BTM_NEG: -; BTM_POS: +; PROD_ID: CONN-11443; TOP_NEG: -; TOP_POS: +
JP1 = SparkFun-Connectors:M08: Header 8 Standard 8-pin 0.1" header. Use with straight break away headers (SKU : PRT-00116), right angle break away headers (PRT-00553), swiss pins (PRT-00743), machine pins (PRT-00117), and female headers (PRT-00115).
JP2 = SparkFun-Connectors:M05: Header 5 Standard 5-pin 0.1" header. Use with straight break away headers (SKU : PRT-00116), right angle break away headers (PRT-00553), swiss pins (PRT-00743), machine pins (PRT-00117), and female headers (PRT-00115). Molex polarized connector foot print use with SKU : PRT-08230 with associated crimp pins and housings.
JP4 JP6 = SparkFun-Connectors:M04: Header 4 Standard 4-pin 0.1" header. Use with straight break away headers (SKU : PRT-00116), right angle break away headers (PRT-00553), swiss pins (PRT-00743), machine pins (PRT-00117), and female headers (PRT-00115). Molex polarized connector foot print use with SKU : PRT-08231 with associated crimp pins and housings. 1MM SMD Version SKU: PRT-10208
JP5 = SparkFun-Connectors:M02: Standard 2-pin 0.1" header. Use with - straight break away headers ( PRT-00116) - right angle break away headers (PRT-00553) - swiss pins (PRT-00743) - machine pins (PRT-00117) - female headers (PRT-00115) Molex polarized connector foot print use with: PRT-08233 with associated crimp pins and housings. 2.54_SCREWTERM for use with PRT-10571. 3.5mm Screw Terminal footprints for PRT-08084 5mm Screw Terminal footprints for use with PRT-08432
L01B = Spark:INDUCTOR-SPARKFUN: Inductors Basic Inductor/Choke - 0603 and 1206. Footprints are not proven and vary greatly between part numbers. SRN6045- 33uH, 20% 1.4A; NR3015T4R7M: 4.7uH
L02B L03B = kennethlimcp:INDUCTOR
LOGO1 = kennethlimcp:OSHW-LOGO: Open Source Hardware Logo This logo indicates the piece of hardware it is found on incorporates a OSHW license and/or adheres to the definition of open source hardware found here: http://freedomdefined.org/OSHW
Q01B Q2 Q02B = SparkFun-DiscreteSemi:MOSFET-PCHANNEL: Generic PMOSFET IRLML2244 - TRANS-11153 (SOT-23 -20V -4.3A) (1.Gate 2.Source 3.Drain) FQP27P06 - COM-10349 <http://www.sparkfun.com/products/10349> (TO-220 -60V -27A) (1.Gate 2.Source 3.Drain)
Q02M = SparkFun-DiscreteSemi:TRANSISTOR_NPN2UP: 2-up package of NPN transistors MMDT3904- TRANS-09373 (SOT-363, 200mA 40V); PROD_ID: TRANS-09373; VALUE: MMDT3904
R01B R01S R02B R02S R03B R03S R04B R04S R05B R06B R07B R08B R09B R10B R11B R12B R13B R14B R15B R16B R17B R20B R21B R22B R23B R24B R25B R26B = SparkFun-Resistors:RESISTOR: Resistor Basic schematic elements and footprints for 0603, 1206, and PTH resistors.
R01M R02D R02M R03D R03M R04D R04M R05D R05M R06D R06M R07D R07M R08D R08M R09D R09M R10D R10M R11D R11M R12D R12M R13D = SparkFun-Passives:RESISTOR: Resistor Basic schematic elements and footprints for 0603, 1206, and PTH resistors.
R18B = adafruit:TRIMPOT: SMT trimmer potentiometer part number TC33X http://www.ladyada.net/library/eagle
S01M S02M = Spark:TAC_SWITCH: SMD Tactiile Switch
TP01B TP17M TP18M U$1 U$5 U$8 U$9 = Spark:TP: Test Points of all sizes and shapes
TP03M = SparkFun-Passives:TEST-POINT: Bare copper test points for troubleshooting or ICT
U1 = SparkFun-PowerIC:MCP73831: Miniature single cell, fully integrated Li-Ion, Li-polymer charge management controller http://ww1.microchip.com/downloads/en/DeviceDoc/20001984g.pdf IC-09995; PROD_ID: IC-09995
U01B = kennethlimcp:BQ2407: 1.5-A USB-Friendly Li-Ion Battery Charger and Power-Path Management IC Series: bq24072, bq24073, bq24074, bq24075, bq24079
U01M = stm32:STM32F10XRXT6: STM32F101/103 64pin LQFP
U01S = SparkFun-Sensors:ADXL345: 3-axis SPI/I2C 2/4/8/16g accelerometer
U02B = Spark:R8008-33
U03B = kennethlimcp:LT1945: LT1945 36V switch, 350mA, Dual micropower DC/DC converter
U04B = kennethlimcp:LM79L15: LM79L15, SOIC-8
U05B = kennethlimcp:LM78L15: LM78L15, SOIC-8
U06B = kennethlimcp:LM358: LM358, two independent, high-gain, Wide Supply Ranges frequency-compensated operational amplifiers MSOP-8
U$4 = kennethlimcp:SWITCH
Y01M = Spark:Q
Y02M = SparkFun-FreqCtrl:CRYSTAL: Various standard crystals. Proven footprints.; PROD_ID: XTAL-08218

## Net classes
0 default: clearance 0.205 mm